# EAGLE design hr (EAGLE 9.5.1)
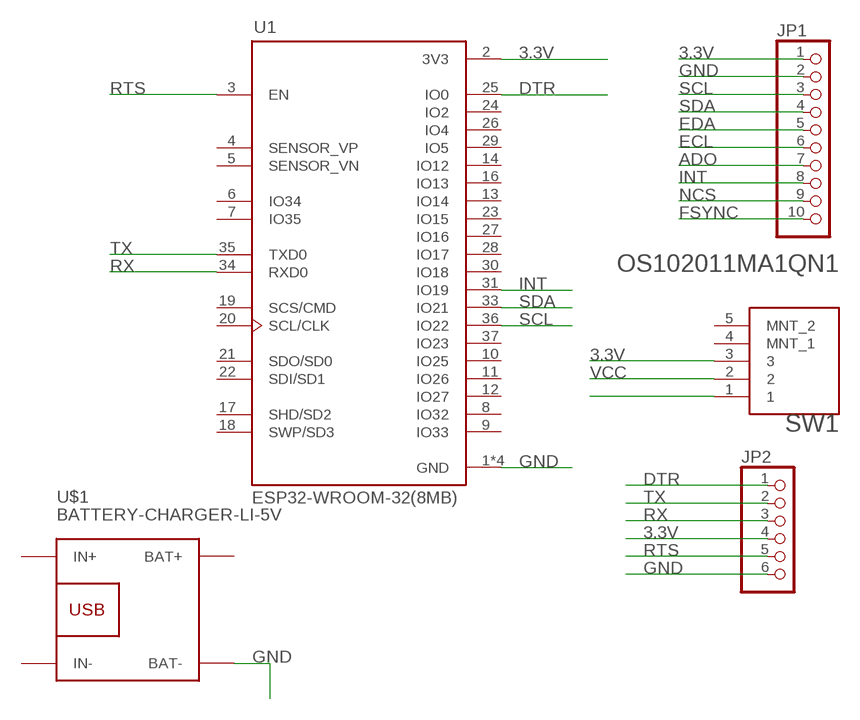
[diagram p0: schematic, sheet 1]

## Parts
JP1  PINHD-1X10  [1X10]
JP2  PINHD-1X6  [1X06]
SW1  C&K_OS102011MA1QN1C&K_OS102011MA1QN1_0_0  [C&K_OS102011MA1QN1_0]
U1  ESP32-WROOM-32(8MB)  [MODULE_ESP32-WROOM-32(8MB)]
U$1  BATTERY-CHARGER-LI-5V  [BATTERY-CHARGER-LI-5V]

## Nets
3.3V: JP1.1 JP2.4 SW1.3 U1.2(3V3)
ADO: JP1.7
DTR: JP2.1 U1.25(IO0)
ECL: JP1.6
EDA: JP1.5
FSYNC: JP1.10
GND: JP1.2 JP2.6 U1.1(GND) U1.15(GND) U1.38(GND) U1.39(GND) U$1.BAT-
INT: JP1.8 U1.31(IO19)
N$2: SW1.1
NCS: JP1.9
RTS: JP2.5 U1.3(EN)
RX: JP2.3 U1.34(RXD0)
SCL: JP1.3 U1.36(IO22)
SDA: JP1.4 U1.33(IO21)
TX: JP2.2 U1.35(TXD0)
VCC: SW1.2
Unconnected: SW1.4(MNT_1) SW1.5(MNT_2) U1.4(SENSOR_VP) U1.5(SENSOR_VN) U1.6(IO34) U1.7(IO35) U1.8(IO32) U1.9(IO33) U1.10(IO25) U1.11(IO26) U1.12(IO27) U1.13(IO14) U1.14(IO12) U1.16(IO13) U1.17(SHD/SD2) U1.18(SWP/SD3) U1.19(SCS/CMD) U1.20(SCL/CLK) U1.21(SDO/SD0) U1.22(SDI/SD1) U1.23(IO15) U1.24(IO2) U1.26(IO4) U1.27(IO16) U1.28(IO17) U1.29(IO5) U1.30(IO18) U1.37(IO23) U$1.BAT+ U$1.IN+ U$1.IN-

## Library data of the parts
JP1 = pinhead:PINHD-1X10: PIN HEADER
JP2 = pinhead:PINHD-1X6: PIN HEADER
SW1 = C&K - OS102011MA1QN1:C&K_OS102011MA1QN1: OS Series Miniature Slide Switches; CENTROID_NOT_SPECIFIED: No; DATASHEET: https://www.ckswitches.com/media/1428/os.pdf; DIGIKEY_DESCRIPTION: SWITCH SLIDE SPDT 100MA 12V; DIGIKEY_PART_NUMBER: CKN9559-ND; LEAD_FREE: yes; MF: C&K; MOUSER_PART_NUMBER: OS102011MA1QN1; MPN: OS102011MA1QN1; PACKAGE: SW_SLIDE; PREFIX: SW; ROHS: yes; TEMPERATURE_RANGE_HIGH: +70°C; TEMPERATURE_RANGE_LOW: -30°C
U1 = ESP32-WROOM-32_8MB_:ESP32-WROOM-32(8MB): WIFI MODULE 64 MBITS SPI FLASH; AVAILABILITY: Unavailable; DESCRIPTION: WIFI MODULE 64 MBITS SPI FLASH; MF: Espressif Systems; MP: ESP32-WROOM-32 _8MB_; PACKAGE: Module Espressif Systems; PRICE: None
U$1 = diy-modules:BATTERY-CHARGER-LI-5V: Lithium Battery 5V Charger More details available here: http://www.buildcircuit.com/how-to-use-micro-usb-5v-1a-lithium-battery-charging-board-charger-module/ Click here to find device on ebay.com <http://www.ebay.com/sch/tp4056+charger+usb>

## Board
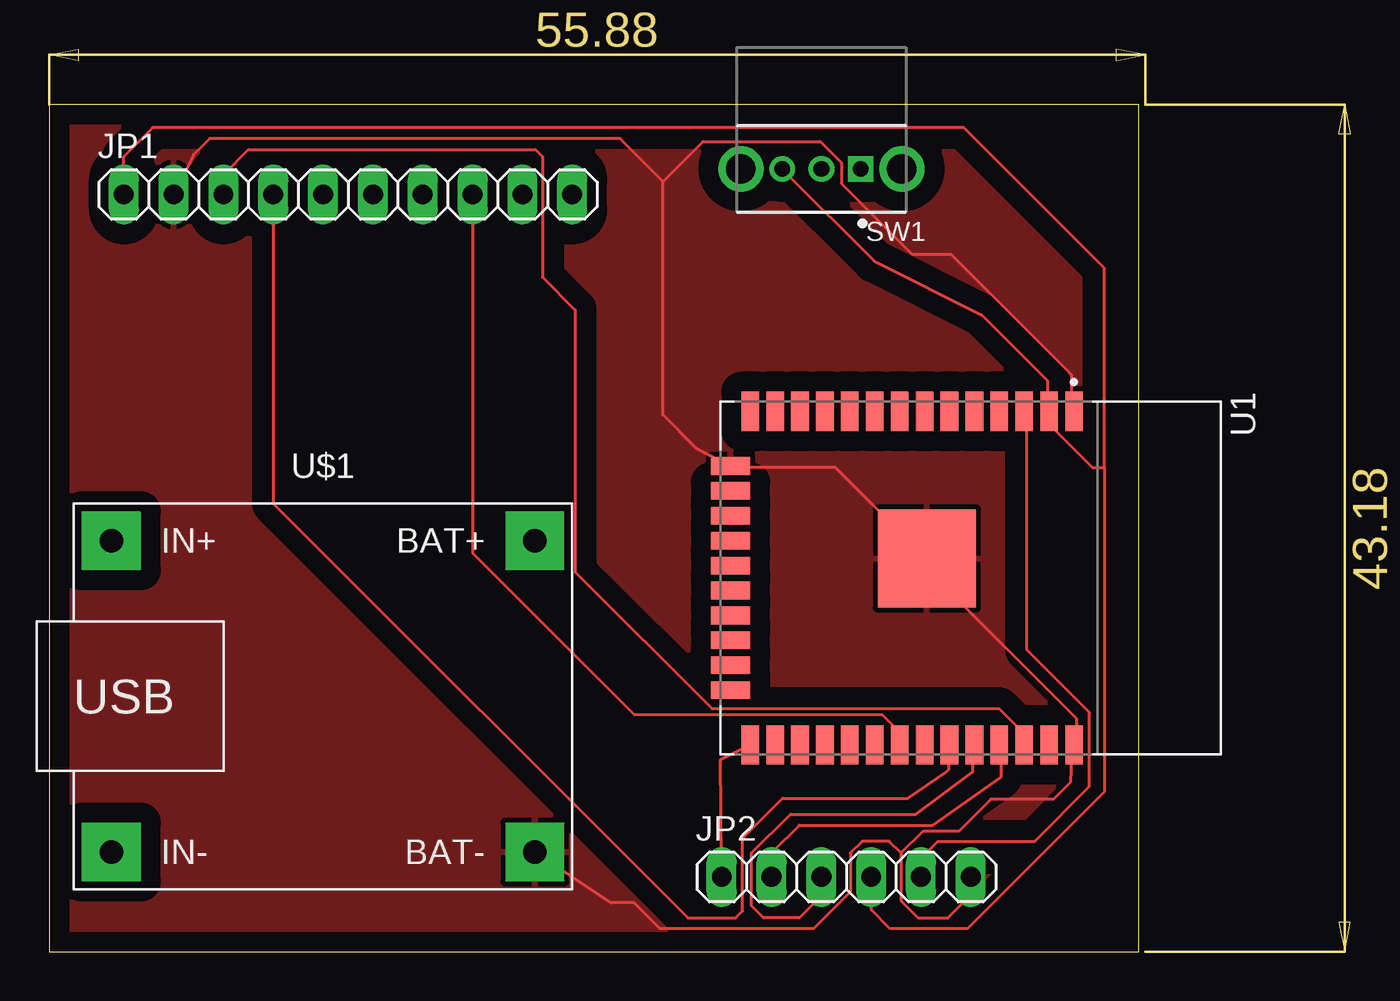
[diagram p1: board, top side]

Size 55.55 x 43.17 mm. Coordinates in mm from the lower left corner, seen from the top.
Outline: 0,0 55.55,0 55.55,43.17 0,43.17 0,0
Copper layers (1*16): Top 0.035mm / dielectric 1.5mm / Bottom 0.035mm
Design rules "default": minimum track width 6mil, minimum drill 0.35mm, track to track 6mil, track to pad 6mil, pad to pad 6mil, via to via 6mil, smd to smd 6mil, copper to edge 40mil, drill to drill 6mil, minimum pad ring 10mil, minimum via ring 8mil, stop-mask expansion 4mil, vias tented up to drill 0mil, thermal gap 10mil

### Footprints (pad centres in the part's own frame; a part is rotated, then mirrored left to right if it is on the bottom)
1X10 = drill 1.016 long: 1 -11.43,0; 2 -8.89,0; 3 -6.35,0; 4 -3.81,0; 5 -1.27,0; 6 1.27,0; 7 3.81,0; 8 6.35,0; 9 8.89,0; 10 11.43,0
1X06 = drill 1.016 long: 1 -6.35,0; 2 -3.81,0; 3 -1.27,0; 4 1.27,0; 5 3.81,0; 6 6.35,0
C&K_OS102011MA1QN1_0 = drill 0.8 pad 1.3 square: 1 -2,2 | drill 0.8 pad 1.3: 2 0,2; 3 2,2 | drill 1.5 pad 2.3: 4 -4.1,2; 5 4.1,2
MODULE_ESP32-WROOM-32(8MB) = smd 2 x 0.9: 1 -8.5,5.26; 2 -8.5,3.99; 3 -8.5,2.72; 4 -8.5,1.45; 5 -8.5,0.18; 6 -8.5,-1.09; 7 -8.5,-2.36; 8 -8.5,-3.63; 9 -8.5,-4.9; 10 -8.5,-6.17; 11 -8.5,-7.44; 12 -8.5,-8.71; 13 -8.5,-9.98; 14 -8.5,-11.25; 25 8.5,-11.25; 26 8.5,-9.98; 27 8.5,-8.71; 28 8.5,-7.44; 29 8.5,-6.17; 30 8.5,-4.9; 31 8.5,-3.63; 32 8.5,-2.36; 33 8.5,-1.09; 34 8.5,0.18; 35 8.5,1.45; 36 8.5,2.72; 37 8.5,3.99; 38 8.5,5.26 | smd 0.9 x 2: 15 -5.715,-12.25; 16 -4.445,-12.25; 17 -3.175,-12.25; 18 -1.905,-12.25; 19 -0.635,-12.25; 20 0.635,-12.25; 21 1.905,-12.25; 22 3.175,-12.25; 23 4.445,-12.25; 24 5.715,-12.25 | smd 5 x 5: 39 -1,-2.24
BATTERY-CHARGER-LI-5V = drill 1.2 pad 3 square: BAT+ 10.795,8.255; BAT- 10.795,-7.62; IN+ -10.795,8.255; IN- -10.795,-7.62

### Placement (x,y rotation side)
JP1  15.24,38.61 0 top
JP2  40.64,3.81 0 top
SW1  39.37,41.91 180 top
U1  46.99,19.05 270 top
U$1  13.97,12.7 0 top

### Tracks (layer width: path | path; a pad name or v marks a point on that pad's centre or on a via)
3.3V
  Top 0.152: SW1.3 37.49,39.78 42.06,35.2 47.55,32.46 50.9,29.11 50.9,27.58 U1.2 51.05,27.43 51.05,26.82 53.19,24.69 53.8,24.69 | JP1.1 3.81,40.54 5.28,42.01 46.63,42.01 53.8,34.85 53.8,24.69 | JP2.4 41.91,2.13 42.88,1.17 46.81,1.17 53.8,8.15 53.8,24.69
DTR
  Top 0.152: JP2.1 34.29,4.42 34.24,9.8 35.66,10.52 U1.25
GND
  Top 0.152: 31.29,39.27 33.33,41.3 39.32,41.3 40.39,40.23 40.39,39.17 43.99,35.56 45.97,35.56 52.12,29.41 52.12,27.58 U1.1 | 31.29,39.27 31.29,27.38 32.99,25.68 U1.15 34.75,24.69 40.08,24.69 44.65,20.12 U1.39 45.75,18.52 52.38,11.89 52.38,10.68 U1.38 52.12,10.52 52.12,9.91 52.07,8.64 51.21,7.77 48.01,7.77 46.38,6.15 44.55,6.15 43.43,5.03 | 31.29,39.27 29.11,41.45 8.18,41.45 7.37,40.64 JP1.2 | JP2.6 46.99,2.9 45.82,1.73 44.3,1.73 43.43,2.59 43.43,5.03 | 43.43,5.03 42.82,5.64 41.45,5.64 40.84,5.03 40.84,3.05 38.96,1.17 31.14,1.17 29.82,2.49 28.65,2.49 U$1.BAT-
  pour Top (isolate 1.016): 0,0 0,43.18 55.88,43.18 55.88,0
INT
  Top 0.152: JP1.8 21.59,20.32 29.82,12.09 42.47,12.09 43.28,11.28 43.28,10.67 U1.31
RTS
  Top 0.152: JP2.5 44.45,4.78 45.31,5.64 50.24,5.64 53.03,8.43 53.03,12.19 49.84,15.39 49.84,27.43 U1.3
RX
  Top 0.152: JP2.3 39.37,2.85 38.25,1.73 36.42,1.73 35.81,2.34 35.81,5.03 37.8,7.01 44.2,7.01 47.09,9.16 47.09,10.52 U1.34
SCL
  Top 0.152: JP1.3 8.89,39.62 10.16,40.89 24.79,40.89 25.15,40.54 25.15,34.39 26.82,32.72 26.82,19.36 33.78,12.39 48.41,12.39 49.68,11.12 49.68,10.67 U1.36
SDA
  Top 0.152: JP1.4 11.43,22.86 32.56,1.73 35,1.73 35.36,2.08 35.36,5.79 37.39,7.82 43.79,7.82 45.72,9.14 45.87,9.3 45.87,10.52 U1.33
TX
  Top 0.152: JP2.2 36.83,5.03 38.25,6.45 45.07,6.45 48.51,8.89 48.51,9.7 48.31,9.91 48.31,10.52 U1.35